# EAGLE design 6-12-19 (EAGLE 9.4.2)
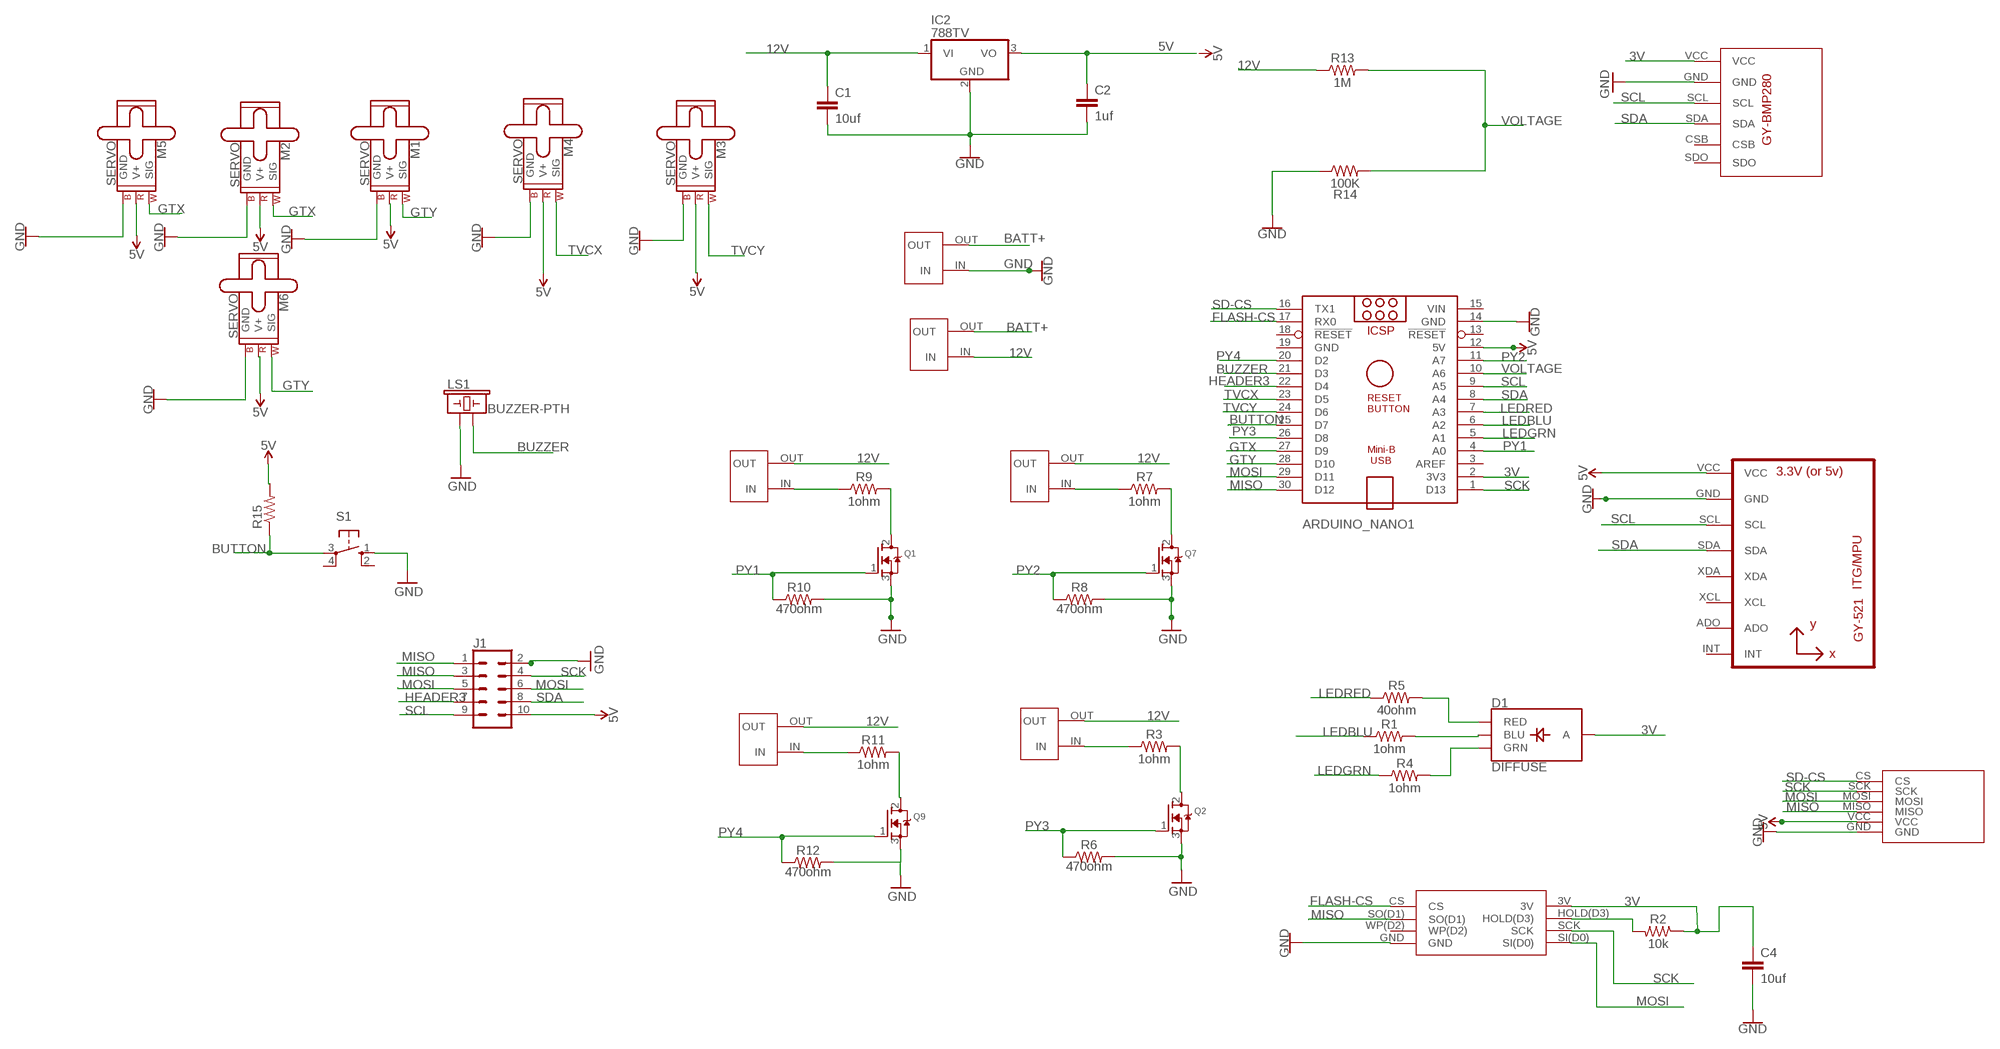
[diagram p0: schematic, sheet 1]

## Parts
ARDUINO_NANO1  ARDUINO_NANO  [ARDUINO_NANO]
C1  10uf  22PF-PTH-2.54MM-200V-5%  [CAP-PTH-2.54]
C2  1uf  22PF-PTH-2.54MM-200V-5%  [CAP-PTH-2.54]
C4  10uf  22PF-PTH-2.54MM-200V-5%  [CAP-PTH-2.54]
D1  DIFFUSE  LED-RGB-CADIFFUSE  [LED-RGB-THRU]
IC2  788TV  [TO220V]
J1  CONN_05X2NO_SILK  [2X5_NOSILK]
LS1  BUZZER-PTH  [BUZZER-12MM]
M1  SERVO  [1X03]
M2  SERVO  [1X03]
M3  SERVO  [1X03]
M4  SERVO  [1X03]
M5  SERVO  [1X03]
M6  SERVO  [1X03]
Q1  MOSFET-NGDS_TO220V  [TO220V]
Q2  MOSFET-NGDS_TO220V  [TO220V]
Q7  MOSFET-NGDS_TO220V  [TO220V]
Q9  MOSFET-NGDS_TO220V  [TO220V]
R1  1ohm  10KOHM-HORIZ-1/4W-1%  [AXIAL-0.3]
R2  10k  10KOHM-HORIZ-1/4W-1%  [AXIAL-0.3]
R3  1ohm  10KOHM-HORIZ-1/4W-1%  [AXIAL-0.3]
R4  1ohm  10KOHM-HORIZ-1/4W-1%  [AXIAL-0.3]
R5  40ohm  10KOHM-HORIZ-1/4W-1%  [AXIAL-0.3]
R6  470ohm  10KOHM-HORIZ-1/4W-1%  [AXIAL-0.3]
R7  1ohm  10KOHM-HORIZ-1/4W-1%  [AXIAL-0.3]
R8  470ohm  10KOHM-HORIZ-1/4W-1%  [AXIAL-0.3]
R9  1ohm  10KOHM-HORIZ-1/4W-1%  [AXIAL-0.3]
R10  470ohm  10KOHM-HORIZ-1/4W-1%  [AXIAL-0.3]
R11  1ohm  10KOHM-HORIZ-1/4W-1%  [AXIAL-0.3]
R12  470ohm  10KOHM-HORIZ-1/4W-1%  [AXIAL-0.3]
R13  1M  10KOHM-HORIZ-1/4W-1%  [AXIAL-0.3]
R14  100K  10KOHM-HORIZ-1/4W-1%  [AXIAL-0.3]
R15  FLIPFLOP-RES  [0805-THM]
S1  40-XX  [B3F-40XX]
U1  GY-521MPU6050  [GY-521]
U$1  TERMINALBLOCK  [TERMINALBLOCK]
U$2  W25Q32FV  [W25Q32FV]
U$6  TERMINALBLOCK  [TERMINALBLOCK]
U$7  TERMINALBLOCK  [TERMINALBLOCK]
U$8  GY-BMP280  [GY-BMP280]
U$9  MICROSDCARD  [MICROSDCARD]
U$11  TERMINALBLOCK  [TERMINALBLOCK]
U$13  TERMINALBLOCK  [TERMINALBLOCK]
U$31  TERMINALBLOCK  [TERMINALBLOCK]

## Nets
3V: ARDUINO_NANO1.2(3V3) C4.1 D1.2(A) R2.P$1 U$2.3V U$8.VCC
5V: ARDUINO_NANO1.12(5V) C2.1 IC2.3(VO) J1.10 M1.2(V+) M2.2(V+) M3.2(V+) M4.2(V+) M5.2(V+) M6.2(V+) R15.2 U1.VCC U$9.VCC
12V: C1.1 IC2.1(VI) R13.P$1 U$1.IN U$7.OUT U$11.OUT U$13.OUT U$31.OUT
BATT+: U$1.OUT U$6.OUT
BUTTON: ARDUINO_NANO1.25(D7) R15.1 S1.3(P)
BUZZER: ARDUINO_NANO1.21(D3) LS1.-
FLASH-CS: ARDUINO_NANO1.17(RX0) U$2.CS
GND: ARDUINO_NANO1.14(GND) C1.2 C2.2 C4.2 IC2.2(GND) J1.2 LS1.+ M1.3(GND) M2.3(GND) M3.3(GND) M4.3(GND) M5.3(GND) M6.3(GND) Q1.3(S) Q2.3(S) Q7.3(S) Q9.3(S) R6.P$2 R8.P$2 R10.P$2 R12.P$2 R14.P$1 S1.1(S) U1.GND U$2.GND U$6.IN U$8.GND U$9.GND
GTX: ARDUINO_NANO1.27(D9) M2.1(SIG) M5.1(SIG)
GTY: ARDUINO_NANO1.28(D10) M1.1(SIG) M6.1(SIG)
HEADER3: ARDUINO_NANO1.22(D4) J1.7
LEDBLU: ARDUINO_NANO1.6(A2) R1.P$1
LEDGRN: ARDUINO_NANO1.5(A1) R4.P$1
LEDRED: ARDUINO_NANO1.7(A3) R5.P$1
MISO: ARDUINO_NANO1.30(D12) J1.1 J1.3 U$2.SO(D1) U$9.MISO
MOSI: ARDUINO_NANO1.29(D11) J1.5 J1.6 U$2.SI(D0) U$9.MOSI
N$1: R2.P$2 U$2.HOLD(D3)
N$2: R9.P$1 U$31.IN
N$3: Q1.2(D) R9.P$2
N$4: D1.1(RED) R5.P$2
N$6: D1.4(BLU) R1.P$2
N$7: D1.3(GRN) R4.P$2
N$8: R3.P$1 U$7.IN
N$9: Q2.2(D) R3.P$2
N$11: Q7.2(D) R7.P$2
N$12: R7.P$1 U$11.IN
N$20: R11.P$1 U$13.IN
N$21: Q9.2(D) R11.P$2
PY1: ARDUINO_NANO1.4(A0) Q1.1(G) R10.P$1
PY2: ARDUINO_NANO1.11(A7) Q7.1(G) R8.P$1
PY3: ARDUINO_NANO1.26(D8) Q2.1(G) R6.P$1
PY4: ARDUINO_NANO1.20(D2) Q9.1(G) R12.P$1
SCK: ARDUINO_NANO1.1(D13) J1.4 U$2.SCK U$9.SCK
SCL: ARDUINO_NANO1.9(A5) J1.9 U1.SCL U$8.SCL
SD-CS: ARDUINO_NANO1.16(TX1) U$9.CS
SDA: ARDUINO_NANO1.8(A4) J1.8 U1.SDA U$8.SDA
TVCX: ARDUINO_NANO1.23(D5) M4.1(SIG)
TVCY: ARDUINO_NANO1.24(D6) M3.1(SIG)
VOLTAGE: ARDUINO_NANO1.10(A6) R13.P$2 R14.P$2
Unconnected: ARDUINO_NANO1.3(AREF) ARDUINO_NANO1.13(!RESET) ARDUINO_NANO1.18(!RESET) S1.2(S1) S1.4(P1) U1.ADO U1.INT U1.XCL U1.XDA U$2.WP(D2) U$8.CSB U$8.SDO

## Power pins joined to a net without a drawn wire
GND: ARDUINO_NANO1.19(GND)
VIN: ARDUINO_NANO1.15(VIN)

## Library data of the parts
ARDUINO_NANO1 = ArduinoNanoV30:ARDUINO_NANO: Arduino Nano V3.0 Overview: The Arduino Nano is a small, complete, and breadboard-friendly board based on the ATmega328 (Arduino Nano 3.x) or ATmega168 (Arduino Nano 2.x). It has more or less the same functionality of the Arduino Duemilanove, but in a different package. It lacks only a DC power jack, and works with a Mini-B USB cable instead of a standard one. The Nano was designed and is being produced by Gravitech. Specifications: Microcontroller Atmel ATmega168 or ATmega328 Operating Voltage (logic level) 5 V Input Voltage (recommended) 7-12 V Input Voltage (limits) 6-20 V Digital I/O Pins 14 (of which 6 provide PWM output) Analog Input Pins 8 DC Current per I/O Pin 40 mA Flash Memory 16 KB (ATmega168) or 32 KB (ATmega328) of which 2 KB used by bootloader SRAM 1 KB (ATmega168) or 2 KB (ATmega328) EEPROM 512 bytes (ATmega168) or 1 KB (ATmega328) Clock Speed 16 MHz Dimensions 0.73" x 1.70" Length 45 mm Width 18 mm Weigth 5 g Power: The Arduino Nano can be powered via the Mini-B USB connection, 6-20V unregulated external power supply (pin 30), or 5V regulated external power supply (pin 27). The power source is automatically selected to the highest voltage source. Memory: The ATmega168 has 16 KB of flash memory for storing code (of which 2 KB is used for the bootloader); the ATmega328 has 32 KB, (also with 2 KB used for the bootloader). The ATmega168 has 1 KB of SRAM and 512 bytes of EEPROM (which can be read and written with the EEPROM library); the ATmega328 has 2 KB of SRAM and 1 KB of EEPROM. Input and Output: Each of the 14 digital pins on the Nano can be used as an input or output, using pinMode(), digitalWrite(), and digitalRead() functions. They operate at 5 volts. Each pin can provide or receive a maximum of 40 mA and has an internal pull-up resistor (disconnected by default) of 20-50 kOhms. In addition, some pins have specialized functions. Visit Arduino - ArduinoBoardNano <https://www.arduino.cc/en/Main/ArduinoBoardNano>
C1 C2 C4 = SparkFun-Capacitors:22PF: 22pF ceramic capacitors A capacitor is a passive two-terminal electrical component used to store electrical energy temporarily in an electric field.; PROD_ID: CAP-09128; VALUE: 22pF
D1 = SparkFun-LED:LED-RGB-CA: LED-RGB Diffused Common Anode Packages: LED RGB-THRU P-LCC-4-3 LED-TRICOLOR-SMD SparkFun Products: RGB Diffused Common Anode- Diffuse <[https://www.sparkfun.com/products/10821]> RGB Diffused Common Anode - Clear <[https://www.sparkfun.com/products/10820]> Qduino Mini <[https://www.sparkfun.com/products/13614]> Triple Output LED RGB - SMD <https://www.sparkfun.com/products/7844>; PROD_ID: DIO-10632
IC2 = linear:78*: Positive VOLTAGE REGULATOR Source: http://cache.national.com/ds/LM/LM78L05.pdf http://www.fairchildsemi.com/ds/LM/LM7805.pdf
J1 = SparkFun-Connectors:CONN_05X2: Multi connection point. Often used as Generic Header-pin footprint for 0.1 inch spaced/style header connections For AVR SPI programming port, see special device with nice symbol: "AVR_SPI_PROG_5x2.dev" You can populate with any combo of single row headers, but if you'd like an exact match, check these: 2x5 AVR ICSP Male Header <https://www.sparkfun.com/products/778> (PRT-00778) 2x5 Pin Shrouded Header <https://www.sparkfun.com/products/8506> (PRT-08506) On any of the 0.1 inch spaced packages, you can populate with these: Break Away Headers - Straight <https://www.sparkfun.com/products/116> (PRT-00116) Break Away Male Headers - Right Angle <https://www.sparkfun.com/products/553> (PRT-00553) Female Headers <https://www.sparkfun.com/products/115> (PRT-00115) Break Away Headers - Machine Pin <https://www.sparkfun.com/products/117> (PRT-00117) Break Away Female Headers - Swiss Machine Pin <https://www.sparkfun.com/products/743> (PRT-00743) Special note: the shrouded connector mates well with our 5x2 ribbon cables: 2x5 Pin IDC Ribbon Cable <https://www.sparkfun.com/products/8535> (PRT-08535)
LS1 = SparkFun-Electromechanical:BUZZER: Buzzer Small round buzzers that operate around the audible 2kHz range. You can use these as speakers to create simple music or user interfaces. Variant Overview: PTH - Mini Speaker - PC Mount 12mm 2.048kHz <https://www.sparkfun.com/products/7950> PTH_KIT - Mini Speaker - PC Mount 12mm 2.048kHz <https://www.sparkfun.com/products/7950> KIT simplifies soldering by adding stop mask to one side of the pads. PTH_NO_SILK - Mini Speaker - PC Mount 12mm 2.048kHz <https://www.sparkfun.com/products/7950> No silkscreen indicator of buzzer outline. PTH_KIT_NO_SILK - Mini Speaker - PC Mount 12mm 2.048kHz <https://www.sparkfun.com/products/7950> KIT package w/o silkscreen SMD - Buzzer Audio Magnetic (CCV-084B16) SMD buzzer used on, e.g. the LilyPad Buzzer <https://www.sparkfun.com/products/8463> and RFID USB Reader <https://www.sparkfun.com/products/9963>. SMD_KIT - Buzzer Audio Magnetic (CCV-084B16) SMD Buzzer with elongated pins to make soldering easier. Used on the SparkFun Simon Says - Surface Mount Soldering Kit <https://www.sparkfun.com/products/10935>.; PROD_ID: COMP-08253; SF_SKU: COM-07950
M1-M6 = SparkFun-Electromechanical:SERVO: Servo Motor 3-pin connector for a standard servo motor (voltage supply, ground, and control signal.) SparkFun Products Servo - Generic (Sub-Micro Size) <https://www.sparkfun.com/products/9065> (ROB-09065) Servo - Generic High Torque Continuous Rotation (Standard Size) <https://www.sparkfun.com/products/9347> (ROB-09347) Servo - Generic High Torque (Standard Size) <https://www.sparkfun.com/products/11965> (ROB-11965)
Q1 Q2 Q7 Q9 = adafruit:MOSFET-N: N-Channel Mosfet 2N7002E - 60V 260mA SOT23 [Digikey: 2N7002ET1GOSTR-ND] - REEL BSH103 - 30V 850mA SOT23 [Digikey: 568-5013-1-ND]
R1 R3-R14 = SparkFun-Resistors:10KOHM: 10kΩ resistor A resistor is a passive two-terminal electrical component that implements electrical resistance as a circuit element. Resistors act to reduce current flow, and, at the same time, act to lower voltage levels within circuits. - Wikipedia; PROD_ID: RES-12183; VALUE: 10k
R2 = SparkFun-Resistors:10KOHM: 10kΩ resistor A resistor is a passive two-terminal electrical component that implements electrical resistance as a circuit element. Resistors act to reduce current flow, and, at the same time, act to lower voltage levels within circuits. - Wikipedia; PROD_ID: RES-12183
R15 = adafruit:FLIPFLOP-RES: Flip Flop resistor An 0805 resistor inside a standard 1/4W 5% resistor. Makes for easy mods
S1 = adafruit:40-XX: OMRON SWITCH; MF: OMRON COMPONENTS USA; MPN: B3F-4000; OC_FARNELL: 176434; OC_NEWARK: 36K3105
U1 = gy-521:GY-521; SPICEPREFIX: X
U$1 U$6 U$7 U$11 U$13 U$31 = TERMINALBLOCK:TERMINALBLOCK
U$2 = W25Q32FV:W25Q32FV
U$8 = gy-BMP280:GY-BMP280
U$9 = MICROSDCARD:MICROSDCARD

## Board
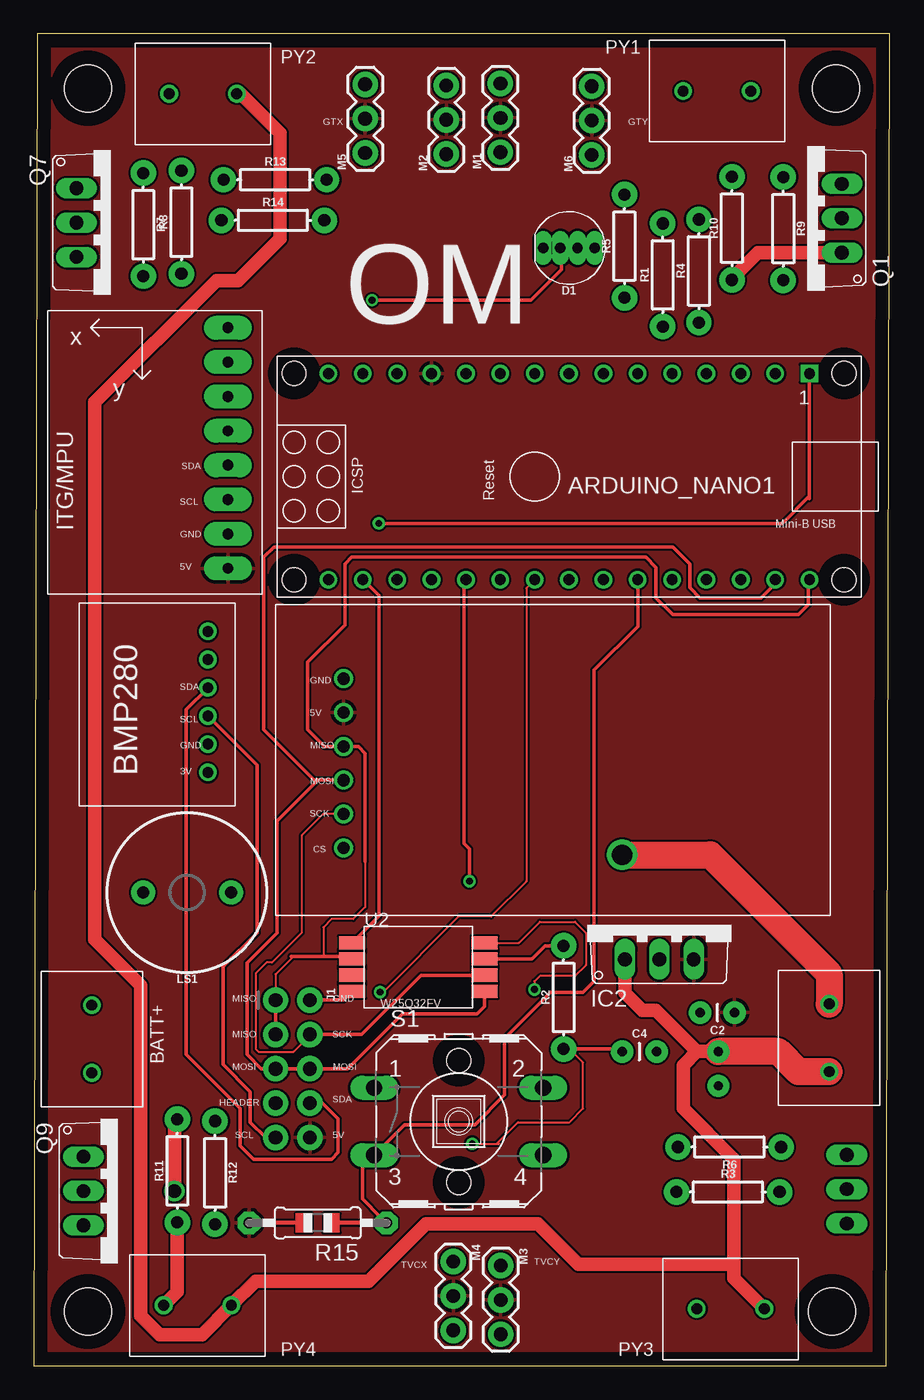
[diagram p1: board, top side]
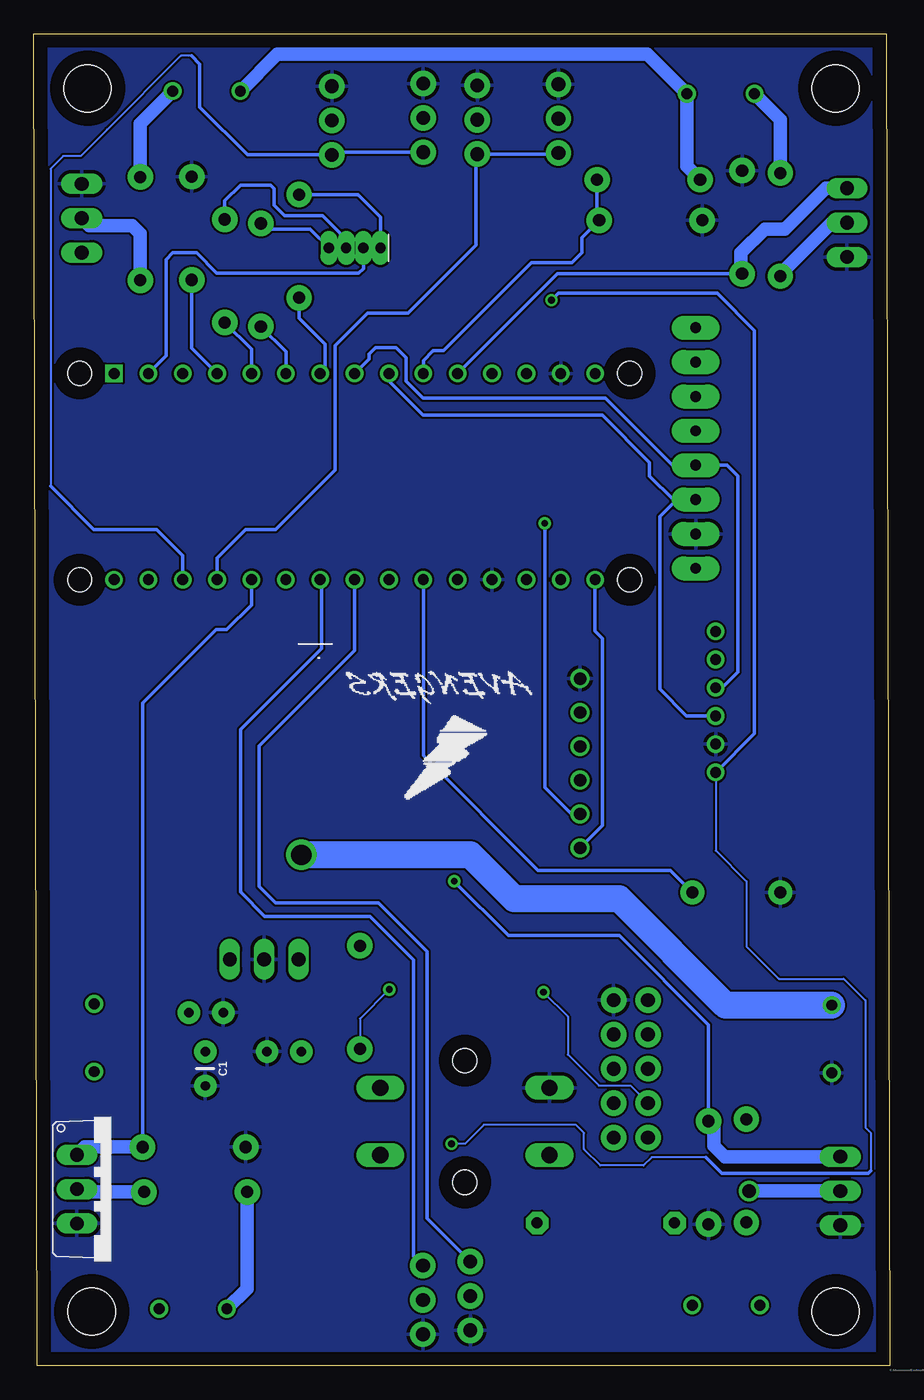
[diagram p2: board, bottom side, seen from below]

Size 63.27 x 98.43 mm. Coordinates in mm from the lower left corner, seen from the top.
Outline: 0,0 63,0 63.27,98.43 0.27,98.43 0,0
Copper layers (1*16): Top 0.035mm / dielectric 1.5mm / Bottom 0.035mm
Design rules "default": minimum track width 6mil, minimum drill 0.35mm, track to track 6mil, track to pad 6mil, pad to pad 6mil, via to via 6mil, smd to smd 6mil, copper to edge 40mil, drill to drill 6mil, minimum pad ring 10mil, minimum via ring 8mil, stop-mask expansion 4mil, vias tented up to drill 0mil, thermal gap 10mil
Holes 3.5 mm at 4,94.4 59.3,94.4 4,4 59,4

### Footprints (pad centres in the part's own frame; a part is rotated, then mirrored left to right if it is on the bottom)
ARDUINO_NANO = drill 0.8 square: 1 -20.32,-7.62 | drill 0.8: 2 -17.78,-7.62; 3 -15.24,-7.62; 4 -12.7,-7.62; 5 -10.16,-7.62; 6 -7.62,-7.62; 7 -5.08,-7.62; 8 -2.54,-7.62; 9 0,-7.62; 10 2.54,-7.62; 11 5.08,-7.62; 12 7.62,-7.62; 13 10.16,-7.62; 14 12.7,-7.62; 15 15.24,-7.62; 16 15.24,7.62; 17 12.7,7.62; 18 10.16,7.62; 19 7.62,7.62; 20 5.08,7.62; 21 2.54,7.62; 22 0,7.62; 23 -2.54,7.62; 24 -5.08,7.62; 25 -7.62,7.62; 26 -10.16,7.62; 27 -12.7,7.62; 28 -15.24,7.62; 29 -17.78,7.62; 30 -20.32,7.62 | hole 1.778: -22.86,-7.62; -22.86,7.62; 17.78,7.62; 17.78,-7.62
CAP-PTH-2.54 = drill 0.7 pad 1.651: 1 -1.27,0; 2 1.27,0
LED-RGB-THRU = drill 0.762 pad 0.889 long: 1 1.905,0; 2 0.635,0; 3 -0.635,0; 4 -1.905,0
TO220V = drill 1.016 long: 1 -2.54,-2.54; 2 0,-2.54; 3 2.54,-2.54
2X5_NOSILK = drill 1.016 pad 1.88: 1 0,0; 2 0,2.54; 3 2.54,0; 4 2.54,2.54; 5 5.08,0; 6 5.08,2.54; 7 7.62,0; 8 7.62,2.54; 9 10.16,0; 10 10.16,2.54
BUZZER-12MM = drill 0.9 pad 1.778: + 3.25,0; - -3.25,0
1X03 = drill 1.016 pad 1.88: 1 0,0; 2 2.54,0; 3 5.08,0
AXIAL-0.3 = drill 0.9 pad 1.88: P$1 -3.81,0; P$2 3.81,0
0805-THM = drill 0.813 pad 1.676 octagon: 1 -5.08,0; 2 5.08,0
B3F-40XX = drill 1.194 long: 1 -6.248,2.489; 2 6.248,2.489; 3 -6.248,-2.489; 4 6.248,-2.489 | hole 1.803: 0,-4.496; 0,4.496
GY-521 = drill 0.8 pad 1.778 long: ADO -8.89,-6.35; GND -8.89,6.35; INT -8.89,-8.89; SCL -8.89,3.81; SDA -8.89,1.27; VCC -8.89,8.89; XCL -8.89,-3.81; XDA -8.89,-1.27
TERMINALBLOCK = drill 0.8: IN 2.5,3.75; OUT 7.5,3.75
W25Q32FV = smd 1.93 x 0.965: 3V 8.9,4.8; CS -0.9,4.8; GND -0.9,1.2; HOLD(D3) 8.9,3.6; SCK 8.9,2.4; SI(D0) 8.9,1.2; SO(D1) -0.9,3.6; WP(D2) -0.9,2.4
GY-BMP280 = drill 0.8: CSB 2,4.166; GND 2,10.415; SCL 2,8.332; SDA 2,6.249; SDO 2,2.083; VCC 2,12.498
MICROSDCARD = drill 0.9: CS 5,5; GND 5,17.5; MISO 5,12.5; MOSI 5,10; SCK 5,7.5; VCC 5,15

### Placement (x,y rotation side)
ARDUINO_NANO1  37.02,65.71 180 top
C1  50.6,21.95 270 bottom
C2  50.53,26.1 180 top
C4  44.76,23.21 0 top
D1  39.55,82.61 180 top
IC2  46.24,32.57 0 top
J1  17.87,27.02 270 top
LS1  11.33,34.97 180 top
M1  34.49,89.68 90 top
M2  30.49,89.54 90 top
M3  34.51,7.4 270 top
M4  31.01,7.69 270 top
M5  24.49,89.62 90 top
M6  41.24,89.48 90 top
Q1  57.19,84.8 90 top
Q2  57.55,13.05 270 bottom
Q7  5.7,84.48 270 top
Q9  6.2,12.91 270 top
R1  46.49,80.61 90 top
R2  39.16,27.22 90 top
R3  51.31,12.84 0 top
R4  49.16,80.9 90 top
R5  43.66,82.74 90 top
R6  51.42,16.16 180 top
R7  8.09,84.33 270 top
R8  10.91,84.51 90 top
R9  55.4,84.03 270 top
R10  51.6,84.06 90 top
R11  10.6,14.4 90 top
R12  13.4,14.26 270 top
R13  17.83,87.65 0 top
R14  17.67,84.65 0 top
R15  20.99,10.55 180 top
S1  31.41,18.05 0 top
U1  5.46,67.82 180 top
U$1  62.55,19.23 90 top
U$2  24.42,26.46 0 top
U$6  8.04,19.14 90 top
U$7  46.5,0.45 0 top
U$8  14.87,56.35 180 top
U$9  17.89,33.27 0 top
U$11  7.5,90.25 0 top
U$13  7.1,0.71 0 top
U$31  55.5,97.95 180 top

### Tracks (layer width: path | path; a pad name or v marks a point on that pad's centre or on a via)
3V  (via drill 0.5)
  Top 0.152: v32.4,16.4 34.2,16.4 | 34.2,16.4 34.4,16.4 | U$2.3V 35.86,31.26 37.4,32.8 40,32.8 40.8,32 40.8,29.6 40,28.8 37.4,28.8 37,28.4 v37,27.8 | 34.2,16.4 35.8,18 39.6,18 40.6,19 40.6,22.4 39.59,23.41 R2.P$1
  Top 0.25: v25,78.75 36.75,78.75 39,81 39,82.53 D1.2 | R2.P$1 43.29,23.41 C4.1
  Bottom 0.152: U$8.VCC 12.87,38.07 10.6,35.8 10.6,31 8.2,28.6 3.4,28.6 1.8,27 1.8,17.6 1.4,17.2 1.4,14.4 | 13.6,15.4 17.6,15.4 18.2,14.8 21.4,14.8 22.6,16 22.6,17.2 23.2,17.8 30,17.8 31.4,16.4 v32.4,16.4 | R2.P$1 39.16,25.64 v37,27.8
  Bottom 0.25: D1.2 38.91,81.08 39.25,80.75 49.75,80.75 51.25,82.25 53,82.25 53.5,81.75 53.5,74.63 ARDUINO_NANO1.2 | U$8.VCC 10,46.72 10,76.5 12.75,79.25 24.5,79.25 v25,78.75 | 1.4,14.4 1.6,14.2 12.4,14.2 13.6,15.4
5V
  pour Top: -7.5,108 71.5,108 71.5,-4.75 -4.75,-4.75 -5.25,-5.25 -5.25,105.75
12V
  Top 1: C1.1 49.03,23.22 | IC2.1 43.7,27.55 45,26.25 46,26.25 49.03,23.22 | 49.03,23.22 48,22.19 48,19 51.75,15.25 51.75,7.5 | U$7.OUT 51.75,6.45 51.75,7.5 | 51.75,7.5 40.25,7.5 37.25,10.5 29,10.5 24.75,6.25 16.39,6.25 U$13.OUT 12.44,2.3 9.3,2.3 7.9,3.7 7.9,28.1 4.5,31.5 4.5,71.2 13.5,80.2 15.1,80.2 18.2,83.3 18.2,91.1 15.3,94 U$11.OUT
  Top 2: U$1.IN 56.52,21.73 55.03,23.22 C1.1
  Bottom 1: R13.P$1 15,88.63 U$11.OUT 17.91,96.91 45.29,96.91 U$31.OUT
BATT+  (via drill 1.5)
  Top 2: v43.5,37.75 50,37.75 58.8,28.95 U$1.OUT
  Bottom 2: U$6.OUT 12.14,26.64 20,34.5 27.75,34.5 31,37.75 v43.5,37.75
BUTTON
  Top 0.25: 25.16,14.84 S1.3 | S1.3 27.4,17.8 32.6,17.8 34.8,20 34.8,24.2 38.2,27.6 40.6,27.6 41.4,28.4 41.4,51.4 44.64,54.64 ARDUINO_NANO1.25 | S1.3 24.3,14.7 24.3,12.32 25.64,10.98 25.67,10.98 25.92,10.73 25.92,10.7 R15.1
BUZZER
  Bottom 0.25: LS1.- 16.21,36.6 26,36.6 34.48,45.08 ARDUINO_NANO1.21
FLASH-CS
  Top 0.25: U$2.CS 25.5,33.24 25.5,56.91 ARDUINO_NANO1.17
GND
  Top 0.25: J1.2 22.88,27.02 U$2.GND
  pour Bottom: -7.5,102.75 66.25,102.75 66.25,-1.75 -7,-1.75 -7,102.25
GTX
  Bottom 0.25: M5.1 24.57,89.54 M2.1 30.6,89.43 30.6,82.8 35.6,77.8 38.6,77.8 41,75.4 41,66.2 45.4,61.8 47.6,61.8 49.72,59.68 ARDUINO_NANO1.27
  Bottom 1: 30.41,89.62 M2.1
GTY
  Bottom 0.152: 51.6,96.8 52.4,96.8 57.85,91.35 57.9,91.3 59.8,89.4 61.1,89.4 62.04,88.46 62.04,65
  Bottom 0.25: M1.1 41.04,89.68 M6.1 47.48,89.48 51,93 51,96.2 51.6,96.8 | 62.04,65 58.84,61.8 54.2,61.8 52.26,59.86 ARDUINO_NANO1.28
HEADER3  (via drill 0.5)
  Top 0.152: ARDUINO_NANO1.22 36.4,57.47 36.4,35.8 33.8,33.2 31.4,33.2 25.8,27.6 v25.6,27.6
  Bottom 0.152: v25.6,27.6 23.8,25.8 23.8,23 21.5,20.7 19.17,20.7 J1.7
LEDBLU
  Bottom 0.25: R1.P$1 44.64,74.95 ARDUINO_NANO1.6
LEDGRN
  Bottom 0.25: R4.P$1 47.18,75.11 ARDUINO_NANO1.5
LEDRED
  Bottom 0.25: R5.P$1 43.66,77.41 41.75,75.5 41.75,73.68 ARDUINO_NANO1.7
MISO
  Top 0.152: 24.5,37.4 24.5,33.9 23.6,33 22,33 21.4,32.4 21.4,30.25 | 19.2,30.25 17.87,28.92 17.87,27
  Top 0.25: ARDUINO_NANO1.30 57.25,58 57.25,56.25 56.5,55.5 47.25,55.5 46,56.75 46,59 45.25,59.75 23.5,59.75 23,59.25 23,54.75 20.25,52 20.25,47 21.48,45.77 U$9.MISO 22.91,45.75 24,45.75 24.5,45.25 24.5,37.4 24.5,37.25 | 19,30.25 19.2,30.25 21.4,30.25 23.33,30.25 U$2.SO(D1) | J1.1 17.87,27 J1.3
MOSI
  Top 0.25: ARDUINO_NANO1.29 54.8,57.8 53.75,56.75 49.25,56.75 48.5,57.5 48.5,59.25 47.25,60.5 17.75,60.5 17,59.75 17,47 20.73,43.27 21,43.27 | 21,43.27 U$9.MOSI | 21,43.27 18,40.27 18,32 15.75,29.75 15.75,23 16.81,21.94 J1.5 J1.6 23.19,21.94 27.25,26 32.75,26 33.32,26.57 U$2.SI(D0)
N$1
  Top 0.25: U$2.HOLD(D3) 36.81,30.06 37.78,31.03 R2.P$2
N$2
  Bottom 1: U$31.IN 55.4,91.8 R9.P$1
N$3
  Bottom 1: Q1.2 59.18,84.25 56,84.25 55.4,83.65 R9.P$2
N$4
  Bottom 0.25: D1.1 37.65,84.89 39.3,86.55 R5.P$2
N$6
  Bottom 0.25: D1.4 42.84,84 46,84 46.25,83.75 46.49,83.99 R1.P$2
N$7
  Bottom 0.25: D1.3 40.54,82.97 40.54,83.62 41.92,85 44.75,85 45.5,85.75 45.5,87 45.75,87.25 48,87.25 49.16,86.09 R4.P$2
N$8
  Bottom 1: U$7.IN 47.5,5.7 R3.P$1
N$9
  Bottom 1: R3.P$2 59.88,12.84 Q2.2
N$11
  Bottom 1: Q7.2 4.27,84.48 8.09,80.66 R7.P$2
N$12
  Bottom 1: U$11.IN 8.09,92.09 R7.P$1
N$20
  Top 1: U$13.IN 10.6,5.46 R11.P$1
N$21  (via drill 1)
  Top 1: v10.4,12.9 10.4,18.01 R11.P$2
  Bottom 1: Q9.2 9.99,12.91 10.1,12.8 10.2,12.9 v10.4,12.9
PY1
  Top 1: R10.P$1 51.6,80.35 53.51,82.26 Q1.1
  Bottom 0.25: R10.P$1 51.6,75.21 ARDUINO_NANO1.4
PY2
  Bottom 0.25: 11,80.7 R8.P$1 24.57,80.7 ARDUINO_NANO1.11
  Bottom 1: Q7.1 4.73,87.02 7.75,84 9.25,84 11,82.25 11,80.7
PY3
  Bottom 0.25: R6.P$1 55.23,48.97 49.8,54.4 49,54.4 47.18,56.22 ARDUINO_NANO1.26
  Bottom 1: R6.P$1 59.52,16.16 Q2.1
PY4  (via drill 0.5)
  Top 0.25: v32.2,35.8 32.2,38.2 31.8,38.6 31.8,57.95 ARDUINO_NANO1.20
  Bottom 0.25: R12.P$1 13.4,25.2 20,31.8 28.2,31.8 v32.2,35.8
  Bottom 1: R12.P$1 13,17.67 13,16.25 12.2,15.45 Q9.1
SCK  (via drill 0.5)
  Top 0.152: U$9.SCK 21.37,40.77 19.8,39.2 19.8,32 17.6,29.8 17.2,29.8 16.4,29 16.4,23.4 16.6,23.2 19.2,23.2 20.41,24.41 J1.4
  Top 0.25: ARDUINO_NANO1.1 57.34,64.25 | 57.34,64.25 57.34,64.09 | 57.34,64.25 55.34,62.25 v25.5,62.25 | J1.4 24.23,24.48 28.61,28.86 U$2.SCK
  Bottom 0.25: v25.5,62.25 25.5,42.75 23.52,40.77 U$9.SCK
SCL
  Top 0.25: U$8.SCL 16.5,44.39 16.5,32 14,29.5 14,22.25 16,20.25 16,18 17.14,16.86 J1.9
  Bottom 0.25: ARDUINO_NANO1.9 37.02,72.77 34.5,70.25 21.25,70.25 17.75,66.75 17.75,65.75 16.01,64.01 U1.SCL 15.74,64.01 17,62.75 17,50 15.02,48.02 U$8.SCL
SD-CS
  Bottom 0.25: ARDUINO_NANO1.16 21.78,54.28 21.25,53.75 21.25,39.91 U$9.CS
SDA
  Top 0.25: U$8.SDA 11.25,48.48 11.25,23 15.25,19 15.25,16.25 16.25,15.25 22,15.25 22.5,15.75 22.5,18.25 21.35,19.4 J1.8
  Bottom 0.25: ARDUINO_NANO1.8 38.5,74.39 38.5,74.75 38,75.25 36.5,75.25 35.75,74.5 35.75,72.75 34.5,71.5 21,71.5 16.05,66.55 U1.SDA 12.05,66.55 11.24,65.74 11.24,51.26 12.4,50.1 U$8.SDA
TVCX
  Bottom 0.25: M4.1 34.2,10.88 34.2,30.6 34.7,31.1 37.8,34.2 45.4,34.2 46.6,35.4 46.6,45.8 39.56,52.84 ARDUINO_NANO1.23
TVCY
  Bottom 0.25: M3.1 35.2,8.09 35.2,30 38.4,33.2 46.2,33.2 48,35 48,47 42,53 42,57.99 ARDUINO_NANO1.24
VOLTAGE
  Bottom 0.25: R13.P$2 21.64,84.81 R14.P$2 22.75,83.38 22.75,82.25 23.5,81.5 26.5,81.5 33,75 33.75,75 34.48,74.27 ARDUINO_NANO1.10

### Text on the board
tPlace: PY1 | PY2 | GTX | GTY | OM | SDA | SCL | GND | 5V | SDA | GND | SCL | 5V | GND | MISO | 3V | MOSI | SCK | CS | MISO | GND | MISO | SCK | BATT+ | MOSI | MOSI | HEADER | SDA | SCL | 5V | TVCX | TVCY | PY4 | PY3
bPlace: C:/Users/user/Desktop/bmgpic.bmp